# EasyEDA Pro project ws2812_clock_PCB.epro, board PCB1
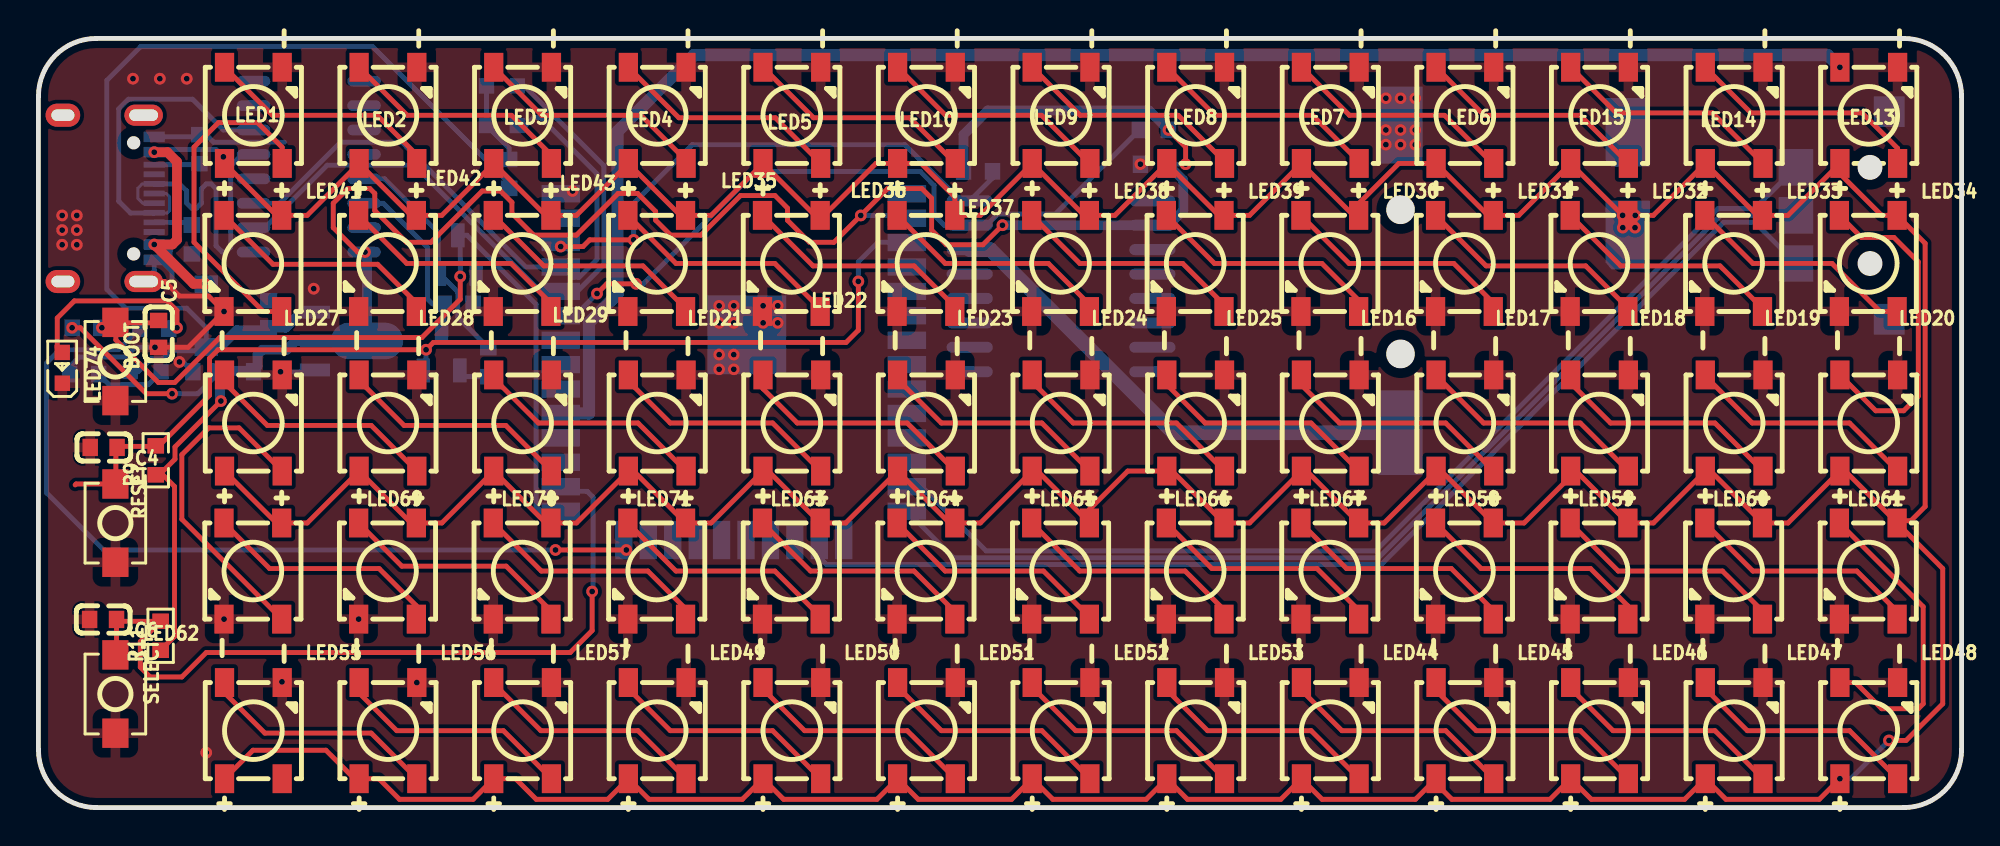
[diagram p4: board, top side]
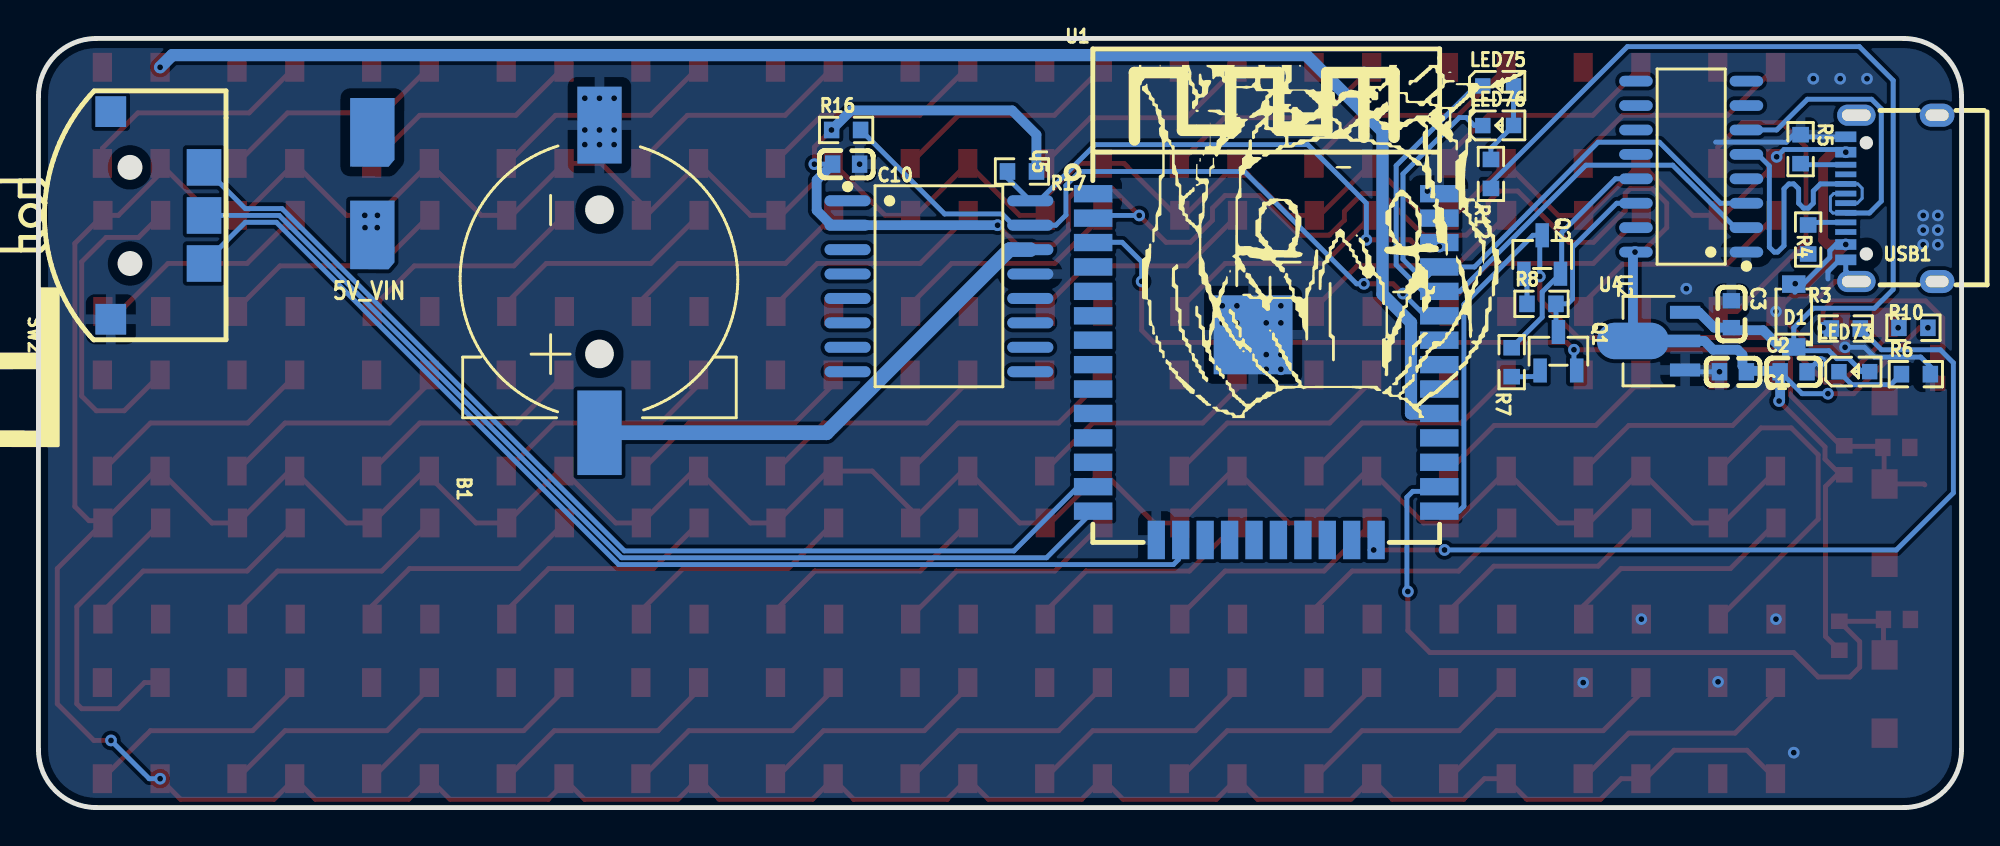
[diagram p5: board, bottom side, seen from below]

Outline 100 x 40 mm; copper layers: Top Layer, Bottom Layer. Coordinates in mm from the lower left corner of the outline.
Outline path: 0,37 0,3 arc(0.88,0.88) 3,0 97,0 arc(99.12,0.88) 100,3 100,37 arc(99.12,39.12) 97,40 3,40 arc(0.88,39.12) 0,37
Stack: Top Layer 0.035mm / Dielectric1 1.51mm FR4 er 4.5 / Bottom Layer 0.035mm

## Design rules (mm)
template: JLCPCB Capability(Two Layers Board)
spacing copperThickness1oz (default): track to track 0.102, other pairs 0.152 to 0.3
spacing copperThickness2oz: track to track 0.203, other pairs 0.152 to 0.3
track width copperThickness1oz (default): min 0.127, default 0.254, max 2.54
track width copperThickness2oz: min 0.203, default 0.254, max 2.54
differential pair differentialPair (default): width min 0.127, default 0.254, max 2.54; gap min 0.152, default 0.152
via viaSize (default): diameter min 0.5, default 0.61, max 10; hole min 0.3, default 0.305, max 6.3

## Placement (name value [footprint] x y rotation side)
B1  CR1220-2  [BAT-SMD_CR1220-2]  70.83 27.49 90 bottom
BOOT  -  [Key_SMD_3x4x2]  4 23.2 270 top
C1  10uF  [C0603]  11.89 22.66 0 bottom
C2  10uF  [C0603]  8.73 22.66 180 bottom
C3  100nF  [C0603]  11.97 25.66 270 bottom
C4  10uF  [C0603]  3.39 18.73 180 top
C5  10uF  [C0603]  6.25 24.63 270 top
C6  10uF  [C0603]  3.36 9.78 180 top
C10  100nF  [C0603]  58 33.46 0 bottom
D1  1N5819HW-7-F  [SOD-123_L2.7-W1.6-LS3.7-RD]  8.72 25.59 90 bottom
LED1  XL-5050RGBC-WS2812B  [LED-SMD_4P-L5.0-W5.0-BL_XL-5050RGBC]  11.17 36 0 top
LED2  XL-5050RGBC-WS2812B  [LED-SMD_4P-L5.0-W5.0-BL_XL-5050RGBC]  18.17 36 0 top
LED3  XL-5050RGBC-WS2812B  [LED-SMD_4P-L5.0-W5.0-BL_XL-5050RGBC]  25.17 36 0 top
LED4  XL-5050RGBC-WS2812B  [LED-SMD_4P-L5.0-W5.0-BL_XL-5050RGBC]  32.18 36 0 top
LED5  XL-5050RGBC-WS2812B  [LED-SMD_4P-L5.0-W5.0-BL_XL-5050RGBC]  39.18 36 0 top
LED6  XL-5050RGBC-WS2812B  [LED-SMD_4P-L5.0-W5.0-BL_XL-5050RGBC]  74.18 36 0 top
LED7  XL-5050RGBC-WS2812B  [LED-SMD_4P-L5.0-W5.0-BL_XL-5050RGBC]  67.18 36 0 top
LED8  XL-5050RGBC-WS2812B  [LED-SMD_4P-L5.0-W5.0-BL_XL-5050RGBC]  60.18 36 0 top
LED9  XL-5050RGBC-WS2812B  [LED-SMD_4P-L5.0-W5.0-BL_XL-5050RGBC]  53.18 36 0 top
LED10  XL-5050RGBC-WS2812B  [LED-SMD_4P-L5.0-W5.0-BL_XL-5050RGBC]  46.18 36 0 top
LED13  XL-5050RGBC-WS2812B  [LED-SMD_4P-L5.0-W5.0-BL_XL-5050RGBC]  95.18 36 0 top
LED14  XL-5050RGBC-WS2812B  [LED-SMD_4P-L5.0-W5.0-BL_XL-5050RGBC]  88.18 36 0 top
LED15  XL-5050RGBC-WS2812B  [LED-SMD_4P-L5.0-W5.0-BL_XL-5050RGBC]  81.18 36 0 top
LED16  XL-5050RGBC-WS2812B  [LED-SMD_4P-L5.0-W5.0-BL_XL-5050RGBC]  67.15 28.3 180 top
LED17  XL-5050RGBC-WS2812B  [LED-SMD_4P-L5.0-W5.0-BL_XL-5050RGBC]  74.15 28.3 180 top
LED18  XL-5050RGBC-WS2812B  [LED-SMD_4P-L5.0-W5.0-BL_XL-5050RGBC]  81.15 28.3 180 top
LED19  XL-5050RGBC-WS2812B  [LED-SMD_4P-L5.0-W5.0-BL_XL-5050RGBC]  88.15 28.3 180 top
LED20  XL-5050RGBC-WS2812B  [LED-SMD_4P-L5.0-W5.0-BL_XL-5050RGBC]  95.15 28.3 180 top
LED21  XL-5050RGBC-WS2812B  [LED-SMD_4P-L5.0-W5.0-BL_XL-5050RGBC]  32.15 28.3 180 top
LED22  XL-5050RGBC-WS2812B  [LED-SMD_4P-L5.0-W5.0-BL_XL-5050RGBC]  39.15 28.3 180 top
LED23  XL-5050RGBC-WS2812B  [LED-SMD_4P-L5.0-W5.0-BL_XL-5050RGBC]  46.15 28.3 180 top
LED24  XL-5050RGBC-WS2812B  [LED-SMD_4P-L5.0-W5.0-BL_XL-5050RGBC]  53.15 28.3 180 top
LED25  XL-5050RGBC-WS2812B  [LED-SMD_4P-L5.0-W5.0-BL_XL-5050RGBC]  60.15 28.3 180 top
LED27  XL-5050RGBC-WS2812B  [LED-SMD_4P-L5.0-W5.0-BL_XL-5050RGBC]  11.15 28.3 180 top
LED28  XL-5050RGBC-WS2812B  [LED-SMD_4P-L5.0-W5.0-BL_XL-5050RGBC]  18.15 28.3 180 top
LED29  XL-5050RGBC-WS2812B  [LED-SMD_4P-L5.0-W5.0-BL_XL-5050RGBC]  25.15 28.3 180 top
LED30  XL-5050RGBC-WS2812B  [LED-SMD_4P-L5.0-W5.0-BL_XL-5050RGBC]  39.18 20 0 top
LED31  XL-5050RGBC-WS2812B  [LED-SMD_4P-L5.0-W5.0-BL_XL-5050RGBC]  32.18 20 0 top
LED32  XL-5050RGBC-WS2812B  [LED-SMD_4P-L5.0-W5.0-BL_XL-5050RGBC]  25.17 20 0 top
LED33  XL-5050RGBC-WS2812B  [LED-SMD_4P-L5.0-W5.0-BL_XL-5050RGBC]  18.17 20 0 top
LED34  XL-5050RGBC-WS2812B  [LED-SMD_4P-L5.0-W5.0-BL_XL-5050RGBC]  11.17 20 0 top
LED35  XL-5050RGBC-WS2812B  [LED-SMD_4P-L5.0-W5.0-BL_XL-5050RGBC]  74.18 20 0 top
LED36  XL-5050RGBC-WS2812B  [LED-SMD_4P-L5.0-W5.0-BL_XL-5050RGBC]  67.18 20 0 top
LED37  XL-5050RGBC-WS2812B  [LED-SMD_4P-L5.0-W5.0-BL_XL-5050RGBC]  60.18 20 0 top
LED38  XL-5050RGBC-WS2812B  [LED-SMD_4P-L5.0-W5.0-BL_XL-5050RGBC]  53.18 20 0 top
LED39  XL-5050RGBC-WS2812B  [LED-SMD_4P-L5.0-W5.0-BL_XL-5050RGBC]  46.18 20 0 top
LED41  XL-5050RGBC-WS2812B  [LED-SMD_4P-L5.0-W5.0-BL_XL-5050RGBC]  95.18 20 0 top
LED42  XL-5050RGBC-WS2812B  [LED-SMD_4P-L5.0-W5.0-BL_XL-5050RGBC]  88.18 20 0 top
LED43  XL-5050RGBC-WS2812B  [LED-SMD_4P-L5.0-W5.0-BL_XL-5050RGBC]  81.18 20 0 top
LED44  XL-5050RGBC-WS2812B  [LED-SMD_4P-L5.0-W5.0-BL_XL-5050RGBC]  67.15 12.3 180 top
LED45  XL-5050RGBC-WS2812B  [LED-SMD_4P-L5.0-W5.0-BL_XL-5050RGBC]  74.15 12.3 180 top
LED46  XL-5050RGBC-WS2812B  [LED-SMD_4P-L5.0-W5.0-BL_XL-5050RGBC]  81.15 12.3 180 top
LED47  XL-5050RGBC-WS2812B  [LED-SMD_4P-L5.0-W5.0-BL_XL-5050RGBC]  88.15 12.3 180 top
LED48  XL-5050RGBC-WS2812B  [LED-SMD_4P-L5.0-W5.0-BL_XL-5050RGBC]  95.15 12.3 180 top
LED49  XL-5050RGBC-WS2812B  [LED-SMD_4P-L5.0-W5.0-BL_XL-5050RGBC]  32.15 12.3 180 top
LED50  XL-5050RGBC-WS2812B  [LED-SMD_4P-L5.0-W5.0-BL_XL-5050RGBC]  39.15 12.3 180 top
LED51  XL-5050RGBC-WS2812B  [LED-SMD_4P-L5.0-W5.0-BL_XL-5050RGBC]  46.15 12.3 180 top
LED52  XL-5050RGBC-WS2812B  [LED-SMD_4P-L5.0-W5.0-BL_XL-5050RGBC]  53.15 12.3 180 top
LED53  XL-5050RGBC-WS2812B  [LED-SMD_4P-L5.0-W5.0-BL_XL-5050RGBC]  60.15 12.3 180 top
LED55  XL-5050RGBC-WS2812B  [LED-SMD_4P-L5.0-W5.0-BL_XL-5050RGBC]  11.15 12.3 180 top
LED56  XL-5050RGBC-WS2812B  [LED-SMD_4P-L5.0-W5.0-BL_XL-5050RGBC]  18.15 12.3 180 top
LED57  XL-5050RGBC-WS2812B  [LED-SMD_4P-L5.0-W5.0-BL_XL-5050RGBC]  25.15 12.3 180 top
LED58  XL-5050RGBC-WS2812B  [LED-SMD_4P-L5.0-W5.0-BL_XL-5050RGBC]  39.18 4 0 top
LED59  XL-5050RGBC-WS2812B  [LED-SMD_4P-L5.0-W5.0-BL_XL-5050RGBC]  32.18 4 0 top
LED60  XL-5050RGBC-WS2812B  [LED-SMD_4P-L5.0-W5.0-BL_XL-5050RGBC]  25.17 4 0 top
LED61  XL-5050RGBC-WS2812B  [LED-SMD_4P-L5.0-W5.0-BL_XL-5050RGBC]  18.17 4 0 top
LED62  XL-5050RGBC-WS2812B  [LED-SMD_4P-L5.0-W5.0-BL_XL-5050RGBC]  11.17 4 0 top
LED63  XL-5050RGBC-WS2812B  [LED-SMD_4P-L5.0-W5.0-BL_XL-5050RGBC]  74.18 4 0 top
LED64  XL-5050RGBC-WS2812B  [LED-SMD_4P-L5.0-W5.0-BL_XL-5050RGBC]  67.18 4 0 top
LED65  XL-5050RGBC-WS2812B  [LED-SMD_4P-L5.0-W5.0-BL_XL-5050RGBC]  60.18 4 0 top
LED66  XL-5050RGBC-WS2812B  [LED-SMD_4P-L5.0-W5.0-BL_XL-5050RGBC]  53.18 4 0 top
LED67  XL-5050RGBC-WS2812B  [LED-SMD_4P-L5.0-W5.0-BL_XL-5050RGBC]  46.18 4 0 top
LED69  XL-5050RGBC-WS2812B  [LED-SMD_4P-L5.0-W5.0-BL_XL-5050RGBC]  95.18 4 0 top
LED70  XL-5050RGBC-WS2812B  [LED-SMD_4P-L5.0-W5.0-BL_XL-5050RGBC]  88.18 4 0 top
LED71  XL-5050RGBC-WS2812B  [LED-SMD_4P-L5.0-W5.0-BL_XL-5050RGBC]  81.18 4 0 top
LED73  -  [LED_0603]  5.52 22.68 180 bottom
LED74  -  [LED_0603]  1.23 22.92 90 top
LED75  -  [LED_0603]  24.05 37.54 180 bottom
LED76  -  [LED_0603]  24.05 35.48 180 bottom
NOREF  -  [Pad_e1269]  82.64 29.78 0 top
NOREF#2  -  [Pad_e1268]  82.64 35.11 0 top
Q1  S8050  [SOT-23-3_L2.9-W1.3-P1.90-LS2.4-BR]  20.96 23.73 270 bottom
Q2  S8050  [SOT-23-3_L2.9-W1.3-P1.90-LS2.4-BR]  21.81 28.76 270 bottom
R3  1K  [R0603]  6.02 24.91 180 bottom
R4  5K1  [R0603]  7.98 29.54 90 bottom
R5  5K1  [R0603]  8.37 34.24 270 bottom
R6  1K  [R0603]  2.38 22.54 180 bottom
R7  10K  [R0603]  23.39 23.16 90 bottom
R8  10K  [R0603]  21.84 26.2 180 bottom
R9  10K  [R0603]  6.1 18.06 90 top
R10  10K  [R0603]  2.5 24.95 0 bottom
R11  10K  [R0603]  6.35 8.93 90 top
R12  10K  [R0603]  24.47 32.95 90 bottom
R16  4.7K  [R0603]  58 35.24 180 bottom
R17  4.7K  [R0603]  48.86 33.08 0 bottom
RESET  -  [Key_SMD_3x4x2]  4 14.79 270 top
SELECT  -  [Key_SMD_3x4x2]  4 5.9 270 top
SW2  TM-2022-3  [SW-SMD_TM-2022-3]  93.81 30.8 90 bottom
U1  ESP32-WROOM-32-N4  [WIFIM-SMD_ESP32-WROOM-32-N4]  36.16 22.92 180 bottom
U2  CH340C  [SOP-16_L10.0-W3.9-P1.27-LS6.0-BL]  14.06 33.33 90 bottom
U4  AMS1117-3.3  [SOT-89_L4.5-W2.5-P1.50-LS4.2-BR]  15.73 24.26 180 bottom
U5  DS3231SN#  [SOIC-16_L10.3-W7.5-P1.27-LS10.3-BL]  53.18 27.11 270 bottom
USB1  TYPE-C 16PIN 2MD(073)  [USB-C-SMD_TYPE-C-6PIN-2MD-073]  3.64 31.68 90 bottom

## Footprints (pads in the part's own frame, mm; a bottom-side part is the same pattern mirrored in y, then rotated)
BAT-SMD_CR1220-2
  rect 4.4x2.3 smd: 1(-8,0)
  rect 4x2.3 smd: 2(8,0)
C0603
  rect 0.8x0.9 smd: 1(-0.7,0) 2(0.7,0)
Key_SMD_3x4x2
  rect 1.53x1.36 smd: 1(-2.035,0) 2(2.035,0)
LED-SMD_4P-L5.0-W5.0-BL_XL-5050RGBC
  rect 1x1.5 smd: 1(-1.5,-2.5) 2(1.5,-2.5) 3(1.5,2.5) 4(-1.5,2.5)
LED_0603
  rect 0.8x0.8 smd: 1(-0.851,-0.01) 2(0.75,-0.005)
Pad_e1268
  custom 2.309x3.577 smd far side: 40(0,0)
Pad_e1269
  custom 2.309x3.577 smd far side: 40(0,0)
R0603
  rect 0.806x0.864 smd: 1(-0.753,0) 2(0.753,0)
SOD-123_L2.7-W1.6-LS3.7-RD
  rect 0.91x1.22 smd: 1(-1.635,0) 2(1.635,0)
SOIC-16_L10.3-W7.5-P1.27-LS10.3-BL
  oval 0.574x2.401 smd: 1(-4.445,-4.75) 2(-3.175,-4.75) 3(-1.905,-4.75) 4(-0.635,-4.75) 5(0.635,-4.75) 6(1.905,-4.75) 7(3.175,-4.75) 8(4.445,-4.75) 9(4.445,4.75) 10(3.175,4.75) 11(1.905,4.75) 12(0.635,4.75) 13(-0.635,4.75) 14(-1.905,4.75) 15(-3.175,4.75) 16(-4.445,4.75)
SOP-16_L10.0-W3.9-P1.27-LS6.0-BL
  oval 0.56x1.745 smd: 1(-4.445,-2.873) 2(-3.175,-2.873) 3(-1.905,-2.873) 4(-0.635,-2.873) 5(0.635,-2.873) 6(1.905,-2.873) 7(3.175,-2.873) 8(4.445,-2.873) 9(4.445,2.873) 10(3.175,2.873) 11(1.905,2.873) 12(0.635,2.873) 13(-0.635,2.873) 14(-1.905,2.873) 15(-3.175,2.873) 16(-4.445,2.873)
SOT-23-3_L2.9-W1.3-P1.90-LS2.4-BR
  rect 1.25x0.7 smd: 1(1,-0.95) 2(1,0.95) 3(-1,0)
SOT-89_L4.5-W2.5-P1.50-LS4.2-BR
  rect 1.575x0.672 smd: 1(1.356,-1.5) 3(1.356,1.5)
  custom 5.377x1.9 smd: 2(-1.356,0.009)
SW-SMD_TM-2022-3
  rect 1.6x1.6 smd: a(-5.4,2.425) a(5.4,2.425)
  rect 1.9x1.8 smd: b(2.5,-2.425) c(0,-2.425) d(-2.5,-2.425)
USB-C-SMD_TYPE-C-6PIN-2MD-073
  rect 0.55x1.1 smd: 1(-3.2,2.375) 2(-2.4,2.375) 11(2.4,2.375) 12(3.2,2.375)
  rect 0.3x1.1 smd: 3(-1.75,2.375) 4(-1.25,2.375) 5(-0.75,2.375) 6(-0.25,2.375) 7(0.25,2.375) 8(0.75,2.375) 9(1.25,2.375) 10(1.75,2.375)
  oval 1.2x1.8 hole 0.6x1.2: 13(-4.325,-2.375) 14(4.325,-2.375)
  oval 1.1x2 hole 0.6x1.5: 13(-4.325,1.825) 14(4.325,1.825)
WIFIM-SMD_ESP32-WROOM-32-N4
  rect 2x0.9 smd: 1(-9,9.005) 2(-9,7.735) 3(-9,6.465) 4(-9,5.195) 5(-9,3.925) 6(-9,2.655) 7(-9,1.385) 8(-9,0.115) 9(-9,-1.155) 10(-9,-2.425) 11(-9,-3.695) 12(-9,-4.965) 13(-9,-6.235) 14(-9,-7.505) 25(9,-7.505) 26(9,-6.235) 27(9,-4.965) 28(9,-3.695) 29(9,-2.425) 30(9,-1.155) 31(9,0.115) 32(9,1.385) 33(9,2.655) 34(9,3.925) 35(9,5.195) 36(9,6.465) 37(9,7.735) 38(9,9.005)
  rect 0.9x2 smd: 15(-5.715,-9.005) 16(-4.445,-9.005) 17(-3.175,-9.005) 18(-1.905,-9.005) 19(-0.635,-9.005) 20(0.635,-9.005) 21(1.905,-9.005) 22(3.175,-9.005) 23(4.445,-9.005) 24(5.715,-9.005)
  rect 4.1x4.1 smd: 39(-0.68,1.665)

## Nets
As in the schematic, except:
GND: B1.2 BOOT.2 C1.2 C2.2 C3.1 C4.2 C5.2 C6.2 C10.1 LED1.3 LED2.3 LED3.3 LED4.3 LED5.3 LED6.3 LED7.3 LED8.3 LED9.3 LED10.3 LED13.3 LED14.3 LED15.3 LED16.3 LED17.3 LED18.3 LED19.3 LED20.3 LED21.3 LED22.3 LED23.3 LED24.3 LED25.3 LED27.3 LED28.3 LED29.3 LED30.3 LED31.3 LED32.3 LED33.3 LED34.3 LED35.3 LED36.3 LED37.3 LED38.3 LED39.3 LED41.3 LED42.3 LED43.3 LED44.3 LED45.3 LED46.3 LED47.3 LED48.3 LED49.3 LED50.3 LED51.3 LED52.3 LED53.3 LED55.3 LED56.3 LED57.3 LED58.3 LED59.3 LED60.3 LED61.3 LED62.3 LED63.3 LED64.3 LED65.3 LED66.3 LED67.3 LED69.3 LED70.3 LED71.3 LED74.1 NOREF#2.40 R4.1 R5.1 R6.2 RESET.2 SELECT.2 SW2.a U1.1 U1.15 U1.38 U1.39 U2.1 U4.1 U5.13 USB1.1 USB1.12
VBUS: D1.2 LED1.1 LED2.1 LED3.1 LED4.1 LED5.1 LED6.1 LED7.1 LED8.1 LED9.1 LED10.1 LED13.1 LED14.1 LED15.1 LED16.1 LED17.1 LED18.1 LED19.1 LED20.1 LED21.1 LED22.1 LED23.1 LED24.1 LED25.1 LED27.1 LED28.1 LED29.1 LED30.1 LED31.1 LED32.1 LED33.1 LED34.1 LED35.1 LED36.1 LED37.1 LED38.1 LED39.1 LED41.1 LED42.1 LED43.1 LED44.1 LED45.1 LED46.1 LED47.1 LED48.1 LED49.1 LED50.1 LED51.1 LED52.1 LED53.1 LED55.1 LED56.1 LED57.1 LED58.1 LED59.1 LED60.1 LED61.1 LED62.1 LED63.1 LED64.1 LED65.1 LED66.1 LED67.1 LED69.1 LED70.1 LED71.1 NOREF.40 USB1.2 USB1.11

Pads without a net: LED62 2; U1 4 5 6 7 8 9 10 11 12 17 18 19 20 22 23 27 28 30 31 32 37; U2 4 7 8 9 10 11 12 15; U5 1 3 4 5 6 7 8 9 10 11 12; USB1 3 9 13 14

## Via types
v1: diameter 0.61, hole 0.305, Top Layer to Bottom Layer, 73 vias

## Routing (per net, layer and track width the routed paths; a pad name or vN(x,y) marks a point on that pad's centre or on a via; arc(x,y) is an arc through that point)
3V3: length 122
  Top Layer w0.254: v1(6.95,21.52) 5.61,21.52 2.18,24.95 v1(1.75,24.95) ; R11.1 7.07,8.9 7.07,16.7 6.47,17.31 6.29,17.31 ; 6.29,17.31 7.1,18.12 7.1,18.76 v1(9.49,21.14) ; 6.29,17.31 R9.1 ; v1(58.76,35.24) 59.65,34.35 v1(59.65,33.46) ; v1(16.98,28.89) 16.6,28.89 15.33,30.16 15.33,31.43 16.09,32.19 17.23,32.19 17.49,31.94 17.49,31.05 19.14,29.4 20.41,29.4 23.08,32.06 24.03,32.06 24.62,31.47 24.62,30.9 25.75,29.77 27.97,29.77 30.14,31.94 31.16,31.94 32.09,31 32.09,30.55 32.87,29.77 34.45,29.77 36.51,31.83 38.3,31.83 38.95,31.18 38.95,30.54 40.09,29.4 41.36,29.4 v1(42.76,30.8) 44.16,32.19 45.94,32.19 46.44,31.68 46.44,30.03 47.21,29.27 49.11,29.27 v1(50.13,30.29)
  Bottom Layer w0.254: C2.1 8.29,21.52 v1(6.95,21.52) ; C10.2 v1(59.65,33.46) ; v1(58.76,35.24) R16.1 ; U1.2 45.02,30.8 v1(42.76,30.8)
  Bottom Layer w0.508: U2.16 17.09,28.73 17.09,24.27 13.37,24.27 12.92,23.81 11.65,23.81 11.39,23.56 11.39,22.97 11.14,22.71 ; 11.14,22.71 9.48,22.71 C2.1 9.43,21.2 v1(9.49,21.14) ; 11.14,22.71 C1.1 ; v1(50.13,30.29) 58.76,30.29 59.53,31.06 59.53,32.63 C10.2 ; R17.1 48.1,34.99 49.37,36.26 57.75,36.26 v1(58.76,35.24)
+5V: length 53.6
  Bottom Layer w0.254: LED73.2 5.19,22.67 5.86,23.35 6.48,23.35 6.9,23.76 8.53,23.76 D1.1 8.72,24.95 7.71,25.97 4.53,25.97 3.56,26.95 3.56,37.82 5.31,39.57 17.38,39.57 24.47,32.48 R12.1
  Bottom Layer w0.508: U4.3 13.66,25.76 12.86,24.96 C3.2 11.83,24.83 10.32,24.83 9.44,23.95 D1.1
GND: length 27.1
  Top Layer w0.254: 5.47,27.36 6.57,27.36 7.33,26.6 8.85,26.6 v1(9.65,25.8) 7.79,23.94 v1(6.06,23.94)
  Bottom Layer w0.254: v1(6.06,23.94) 5.04,23.94 4.53,23.43 2.12,23.43 1.62,22.93 R6.2 ; 8.03,22.66 7.52,23.17 v1(7.33,23.17) ; USB1.12 8.26,34.88 R5.1 8.72,35 9.11,34.61 12.79,34.61 ; v1(12.59,22.66) 14.28,22.66 U4.1 ; 5.47,27.36 6.02,27.91 USB1.1 6.34,28.48 6.95,27.87 6.95,27.49
  vias: v1(1.23,30.8) v1(1.23,30.03) v1(1.23,29.27) v1(1.99,30.8) v1(1.99,30.03) v1(1.99,29.27) v1(4.92,37.91) v1(6.31,37.91) v1(7.71,37.91) v1(8.72,2.86) v1(9.65,9.8) v1(12.66,6.54) v1(14.31,26.98) v1(16.65,9.8) v1(19.67,6.5) v1(27.78,32.06) v1(35.4,26.1) v1(35.4,25.21) v1(35.4,23.56) v1(35.4,22.79) v1(36.16,26.1) v1(36.16,25.21) v1(36.16,23.56) v1(36.16,22.79) v1(37.68,26.1) v1(37.68,25.21) v1(38.44,26.1) v1(38.44,25.21) v1(57.3,33.46) v1(70.07,36.89) v1(70.07,35.24) v1(70.07,34.48) v1(70.83,36.89) v1(70.83,35.24) v1(70.83,34.48) v1(71.59,36.89) v1(71.59,35.24) v1(71.59,34.48)
VBUS: length 380.4
  Top Layer w0.254: v1(93.68,1.5) 92.6,0.43 87.75,0.43 LED70.1 85.6,0.43 80.75,0.43 LED71.1 78.6,0.43 73.5,0.43 72.68,1.25 LED63.1 71.6,0.43 66.75,0.43 LED64.1 64.6,0.43 59.75,0.43 LED65.1 57.6,0.43 52.75,0.43 LED66.1 50.6,0.43 45.75,0.43 LED67.1 43.6,0.43 38.75,0.43 LED58.1 36.6,0.43 31.75,0.43 LED59.1 29.6,0.43 25.89,0.43 24.81,1.5 LED60.1 22.6,0.43 18.77,0.43 17.7,1.5 LED61.1 16.43,1.5 14.95,2.98 11.16,2.98 LED62.1 ; 79.95,17.5 77.25,14.8 LED45.1 72.95,17.5 LED35.1 69.97,14.8 LED44.1 65.95,17.5 LED36.1 62.97,14.8 LED53.1 58.95,17.5 LED37.1 56.64,17.5 54.65,15.51 LED52.1 51.95,17.5 LED38.1 48.97,14.8 LED51.1 47.38,14.8 LED39.1 41.97,14.8 LED50.1 37.95,17.5 LED30.1 34.97,14.8 LED49.1 30.95,17.5 LED31.1 27.97,14.8 LED57.1 26.38,14.8 LED32.1 20.97,14.8 LED56.1 19.38,14.8 LED33.1 13.97,14.8 LED55.1 12.38,14.8 LED34.1 ; 79.95,17.5 LED46.1 83.97,14.8 LED42.1 86.95,17.5 LED47.1 90.97,14.8 LED41.1 93.95,17.5 LED48.1 ; 79.95,17.5 LED43.1 ; v1(96.23,3.49) 97.12,3.49 99.02,5.39 99.02,12.43 LED48.1 ; 40.85,30.8 LED22.1 ; 40.85,30.8 43.55,33.5 LED10.1 45.9,33.5 47.65,31.75 LED23.1 48.97,30.8 LED9.1 54.38,30.8 LED24.1 55.97,30.8 LED8.1 61.38,30.8 LED25.1 62.97,30.8 LED7.1 68.38,30.8 LED16.1 68.65,31.41 70.74,33.5 LED6.1 75.38,30.8 LED17.1 76.97,30.8 LED15.1 v1(82.38,30.8) LED18.1 v1(83.03,30.8) 83.97,30.8 LED14.1 89.38,30.8 LED19.1 90.97,30.8 LED13.1 93.68,32.97 95.84,30.8 LED20.1 98.11,29.34 98.11,15.66 97.37,14.92 96.77,14.92 LED48.1 ; 40.85,30.8 40.85,30.41 40.76,30.41 LED5.1 34.97,30.8 LED21.1 33.38,30.8 LED4.1 27.97,30.8 LED29.1 26.38,30.8 LED3.1 20.97,30.8 LED28.1 19.38,30.8 LED2.1 13.97,30.8 LED27.1 12.38,30.8 LED1.1
  Top Layer w0.508: v1(6.02,34.08) 6.71,34.08 7.2,33.59 7.2,29.53 6.96,29.28 v1(6.02,29.28) 8.06,27.24 8.6,27.24
  Bottom Layer w0.254: v1(6.02,34.08) 6.16,34.22 9.23,34.22 v1(9.61,33.84) ; v1(96.23,3.49) 94.24,1.5 v1(93.68,1.5) ; 8.67,26.8 8.23,27.24 8.22,27.24 6.85,28.61 6.85,28.97 6.53,29.28 v1(6.02,29.28)
  vias: v1(8.65,27.24) v1(82.38,30.16) v1(83.02,30.16)
D+: length 17.2
  Bottom Layer w0.152: USB1.8 5.39,32.43 5.17,32.21 5.17,31.68 5.42,31.43 USB1.6
  Bottom Layer w0.254: USB1.8 7.34,32.43 7.71,32.06 7.71,31.43 7.96,31.18 8.22,31.18 8.47,31.43 8.47,32.18 8.72,32.43 8.98,32.43 9.23,32.18 9.23,29.22 9.56,28.89 9.74,28.89 10,29.14 10,33.37 10.59,33.97 U2.5
D-: length 17.2
  Bottom Layer w0.152: USB1.7 6.65,31.93 6.82,31.76 6.82,31.05 6.69,30.92 6.03,30.92 USB1.5
  Bottom Layer w0.254: U2.6 9.61,35.24 8.02,36.84 4.68,36.84 4.17,36.33 4.17,31.54 4.79,30.92 6.01,30.92 USB1.5
DOWN_KEY: length 60.1
  Bottom Layer w0.254: SW2.d 89.25,30.44 87.63,30.44 69.83,12.64 40.98,12.64 40.73,12.89 40.73,13.92
DTR: length 12.1
  Bottom Layer w0.254: U2.13 18,32.7 20.79,29.91 20.79,27.83 Q2.2 21.81,26.81 21.81,25.5 R7.2
EN: length 54.1
  Top Layer w0.254: 1.91,16.78 1.96,16.83 4.03,16.83 4.03,18.75 4.06,18.78 6.07,18.78 R9.2 6.27,18.81 8.9,21.44 8.9,23.37 9.34,23.81 v1(20.16,23.81) 20.54,24.19 42,24.19 42.63,24.83 v1(42.63,27.37)
  Bottom Layer w0.254: 45.28,29.39 45.27,29.4 43.65,29.4 42.63,28.38 v1(42.63,27.37) ; v1(20.16,23.81) 20.16,22.88 Q1.2
IO0: length 44.7
  Top Layer w0.254: C5.1 6.12,25.21 4.03,25.21 4.03,24.32 6.24,22.11 7.09,22.11 9.42,24.44 19.94,24.44 21.93,26.44 v1(21.93,27.62)
  Bottom Layer w0.254: 27.28,15.42 26.13,15.42 25.88,15.67 25.88,26.17 22.28,29.76 Q2.3 21.93,29.64 v1(21.93,27.62)
  vias: v1(3.3,24.95)
IO2: length 43.7
  Top Layer w0.254: v1(26.89,13.4) v1(30.57,13.4)
  Bottom Layer w0.254: 5.27,24.91 4.16,23.81 1.11,23.81 0.43,23.13 0.43,16.36 3.39,13.4 v1(26.89,13.4)
IO4: length 40.5
  Top Layer w0.254: 4.03,7.94 4.06,7.97 C6.1 4.16,9.69 6.35,9.69 5.3,8.63 5.3,7.3 5.8,6.79 7.45,6.79 8.72,8.06 27.65,8.06 28.79,9.2 v1(28.79,11.24)
  Bottom Layer w0.254: v1(28.79,11.24) 28.84,11.29 28.84,16.14 28.54,16.44 27.53,16.44 27.28,16.69
LED_IN: length 82.1
  Bottom Layer w0.635: v1(93.68,38.5) 93.04,39.14 34.08,39.14 30.11,35.16 30.11,26.7 28.63,25.22 28.63,20.5 27.28,20.5
PUSH_KEY: length 54.6
  Bottom Layer w0.254: SW2.c 87.48,30.8 69.68,12.99 47.58,12.99 U1.14
RTS: length 9.4
  Bottom Layer w0.254: U2.14 17.93,31.43 20.23,29.13 20.23,26.45 20.48,26.2 R8.2 21.09,24.86 Q1.3
RXD: length 34.2
  Bottom Layer w0.254: U2.2 11.77,30.16 15.02,33.41 19.53,33.41 26.09,26.85 27.28,26.85 27.3,26.86 28.03,26.86 29.4,28.23 29.4,33.38 25.26,37.53 LED75.1
SCL: length 27.8
  Top Layer w0.254: v1(30.95,29.53) 28.66,29.53 28.32,29.18 v1(27.16,29.18)
  Bottom Layer w0.254: v1(30.95,29.53) 30.95,31.43 34,34.48 45.05,34.48 47.97,31.56 U5.16 49.61,32.74 R17.2
SDA: length 37.3
  Top Layer w0.254: v1(29.04,26.73) 29.55,27.24 v1(31.08,27.24)
  Bottom Layer w0.254: v1(29.04,26.73) 27.89,25.58 27.16,25.58 ; R16.2 52.88,30.87 49.88,30.87 49.3,30.29 47.1,30.29 46.57,30.81 46.57,32.36 45.85,33.08 37.3,33.08 31.46,27.24 v1(31.08,27.24)
TXD: length 32.5
  Bottom Layer w0.254: U2.3 12.53,31.43 15.71,34.61 18.9,34.61 25.33,28.12 27.28,28.12 27.82,27.58 28.11,27.58 29.04,28.51 29.04,32.95 26.11,35.89 25.75,35.89 25.34,35.47 LED76.1
UP_KEY: length 55.6
  Bottom Layer w0.254: SW2.b 89.25,31.15 87.33,31.15 69.53,13.35 49.28,13.35 45.61,17.01
$1N4092: length 12.5
  Top Layer w0.254: LED14.4 89.05,36.13 94.83,36.13 96.68,34.28 LED13.2
$1N4097: length 12.1
  Top Layer w0.254: LED7.2 68.68,33.58 66.26,36 61.17,36 LED8.4
$1N4102: length 12.1
  Top Layer w0.254: LED6.2 75.62,33.5 73.11,36 68.17,36 LED7.4
$1N4107: length 12.1
  Top Layer w0.254: LED9.4 54.17,36 59.27,36 61.68,33.6 LED8.2
$1N4112: length 12.1
  Top Layer w0.254: LED9.2 54.66,33.5 52.16,36 47.17,36 LED10.4
$1N4117: length 12.1
  Top Layer w0.254: LED5.4 40.3,35.88 45.3,35.88 LED10.2
$1N4122: length 12.1
  Top Layer w0.254: LED5.2 40.68,33.52 38.32,35.88 33.3,35.88 LED4.4
$1N4127: length 12.3
  Top Layer w0.254: LED2.2 19.67,33.94 17.61,36 12.17,36 LED1.4
$1N5780: length 12.1
  Top Layer w0.254: LED15.2 80.17,36 75.17,36 LED6.4
$1N5785: length 12.1
  Top Layer w0.254: LED14.2 87.05,36.13 82.05,36.13 LED15.4
$1N5790: length 12.3
  Top Layer w0.254: LED2.4 19.17,36 24.6,36 26.67,33.93 LED3.2
$1N5795: length 12.2
  Top Layer w0.254: LED4.2 33.68,33.66 31.33,36 26.17,36 LED3.4
$1N7419: length 12.1
  Top Layer w0.254: LED20.4 95.76,25.8 93.26,28.3 89.15,28.3 LED19.2
$1N7423: length 12.2
  Top Layer w0.254: LED18.2 82.28,28.17 87.44,28.17 89.65,25.96 LED19.4
$1N7427: length 12.2
  Top Layer w0.254: LED18.4 82.65,25.98 80.45,28.17 75.28,28.17 LED17.2
$1N7431: length 12.3
  Top Layer w0.254: LED16.2 68.15,28.3 73.6,28.3 75.65,26.25 LED17.4
$1N7435: length 12.4
  Top Layer w0.254: LED16.4 68.65,26.39 66.74,28.3 61.15,28.3 LED25.2
$1N7439: length 12.3
  Top Layer w0.254: LED24.2 54.15,28.3 59.5,28.3 61.65,26.15 LED25.4
$1N7443: length 12.3
  Top Layer w0.254: LED23.2 47.15,28.3 52.51,28.3 54.65,26.16 LED24.4
$1N7447: length 12.2
  Top Layer w0.254: LED22.2 40.28,28.17 45.53,28.17 47.65,26.05 LED23.4
$1N7451: length 12.2
  Top Layer w0.254: LED21.2 33.15,28.3 38.29,28.3 40.65,25.94 LED22.4
$1N7455: length 12.2
  Top Layer w0.254: LED29.2 26.28,28.17 31.43,28.17 33.65,25.95 LED21.4
$1N7459: length 12.3
  Top Layer w0.254: LED28.2 19.15,28.3 24.57,28.3 26.65,26.22 LED29.4
$1N7463: length 12.3
  Top Layer w0.254: LED27.2 12.19,28.25 17.63,28.25 19.65,26.24 LED28.4
$1N7531: length 17.5
  Top Layer w0.254: LED27.4 11.69,25.8 8.09,29.4 8.09,34.35 9.36,35.62 11.39,35.62 12.67,34.34 LED1.2
$1N9831: length 12.3
  Top Layer w0.254: LED33.2 17.3,19.87 11.9,19.87 9.67,22.1 LED34.4
$1N9835: length 12.2
  Top Layer w0.254: LED32.2 24.3,19.87 19.01,19.87 16.67,22.21 LED33.4
$1N9839: length 12.2
  Top Layer w0.254: LED31.2 31.18,20 26,20 23.67,22.32 LED32.4
$1N9843: length 12.3
  Top Layer w0.254: LED30.2 38.18,20 32.85,20 30.68,22.18 LED31.4
$1N9847: length 12.5
  Top Layer w0.254: LED39.2 45.18,20 39.46,20 37.68,21.78 LED30.4
$1N9851: length 12.2
  Top Layer w0.254: LED39.4 44.68,22.28 46.95,20 52.18,20 LED38.2
$1N9855: length 12.3
  Top Layer w0.254: LED37.2 59.18,20 53.81,20 51.68,22.14 LED38.4
$1N9859: length 12.4
  Top Layer w0.254: LED36.2 66.18,20 60.67,20 58.68,21.99 LED37.4
$1N9863: length 12.4
  Top Layer w0.254: LED36.4 65.68,21.98 67.65,20 73.18,20 LED35.2
$1N9867: length 12.1
  Top Layer w0.254: LED43.2 80.18,20 75.15,20 72.68,22.47 LED35.4
$1N9871: length 12.3
  Top Layer w0.254: LED42.2 87.18,20 81.75,20 79.68,22.08 LED43.4
$1N9875: length 12.1
  Top Layer w0.254: LED42.4 86.68,22.44 89.12,20 94.18,20 LED41.2
$1N10622: length 12.3
  Top Layer w0.254: LED48.4 96.65,10.2 94.55,12.3 89.15,12.3 LED47.2
$1N10626: length 12.3
  Top Layer w0.254: LED46.2 82.15,12.3 87.57,12.3 89.65,10.22 LED47.4
$1N10630: length 12.5
  Top Layer w0.254: LED45.2 75.02,12.43 80.71,12.43 82.65,10.49 LED46.4
$1N10634: length 12.3
  Top Layer w0.254: LED44.2 68.02,12.43 73.47,12.43 75.65,10.25 LED45.4
$1N10638: length 12.3
  Top Layer w0.254: LED44.4 68.65,10.26 66.48,12.43 61.02,12.43 LED53.2
$1N10642: length 12.4
  Top Layer w0.254: LED52.2 54.15,12.3 59.63,12.3 61.65,10.28 LED53.4
$1N10646: length 12.1
  Top Layer w0.254: LED52.4 54.65,9.91 52.26,12.3 47.15,12.3 LED51.2
$1N10650: length 12.3
  Top Layer w0.254: LED51.4 47.65,10.18 45.53,12.3 40.15,12.3 LED50.2
$1N10654: length 12.2
  Top Layer w0.254: LED49.2 33.15,12.3 38.29,12.3 40.65,9.94 LED50.4
$1N10658: length 12.4
  Top Layer w0.254: LED57.2 26.15,12.3 31.69,12.3 33.65,10.34 LED49.4
$1N10662: length 12.3
  Top Layer w0.254: LED57.4 26.65,10.23 24.32,12.56 18.89,12.56 LED56.2
$1N10666: length 12.5
  Top Layer w0.254: LED56.4 19.65,10.5 17.72,12.43 12.02,12.43 LED55.2
$1N11413: length 12.4
  Top Layer w0.254: LED61.2 17.3,3.87 11.77,3.87 9.67,5.97 LED62.4
$1N11417: length 12.4
  Top Layer w0.254: LED60.2 24.18,4 18.63,4 16.67,5.95 LED61.4
$1N11421: length 12.1
  Top Layer w0.254: LED60.4 23.67,6.45 26.12,4 31.18,4 LED59.2
$1N11425: length 12.3
  Top Layer w0.254: LED58.2 38.18,4 32.85,4 30.68,6.18 LED59.4
$1N11429: length 12.3
  Top Layer w0.254: LED67.2 45.18,4 39.84,4 37.68,6.16 LED58.4
$1N11433: length 12.2
  Top Layer w0.254: LED67.4 44.68,6.28 46.95,4 52.18,4 LED66.2
$1N11437: length 12.2
  Top Layer w0.254: LED66.4 51.68,6.26 53.94,4 59.18,4 LED65.2
$1N11441: length 12.3
  Top Layer w0.254: LED64.2 66.18,4 60.79,4 58.68,6.12 LED65.4
$1N11445: length 12.3
  Top Layer w0.254: LED63.2 73.18,4 67.78,4 65.68,6.1 LED64.4
$1N11449: length 12.3
  Top Layer w0.254: LED71.2 80.18,4 74.76,4 72.68,6.09 LED63.4
$1N11453: length 12.2
  Top Layer w0.254: LED71.4 79.68,6.2 81.88,4 87.18,4 LED70.2
$1N11457: length 12.3
  Top Layer w0.254: LED70.4 86.68,6.19 88.86,4 94.18,4 LED69.2
$1N11461: length 16.2
  Top Layer w0.254: LED48.2 98.01,10.44 98.01,5.39 97.75,5.14 95.85,5.14 94.49,6.5 LED69.4
$1N11531: length 17.3
  Top Layer w0.254: LED20.2 94.8,29.65 96.48,29.65 97.75,28.38 97.75,21.4 96.99,20.64 95.54,20.64 LED41.4
$1N11542: length 17.4
  Top Layer w0.254: LED55.4 7.45,14.99 7.45,18.35 8.85,19.75 10.43,19.75 LED34.2
$1N14391: length 2.4
  Bottom Layer w0.254: R5.2 8.31,33.43 USB1.10
$1N14400: length 2.1
  Bottom Layer w0.254: USB1.4 7.58,30.43 7.98,30.04
$1N15566: length 3.8
  Bottom Layer w0.254: LED73.1 5.7,21.99 3.68,21.99 R6.1
$1N15790: length 1.6
  Bottom Layer w0.254: R7.1 22.57,22.41 22.57,22.41 22.23,22.41 Q1.1
$1N15816: length 1.6
  Bottom Layer w0.254: Q2.1 22.6,27.6 R8.1
$1N18906: length 10
  Top Layer w0.254: LED74.2 0.98,23.93 0.98,25.46 1.87,26.35 6.69,26.35 7.2,25.84 v1(7.2,24.95)
  Bottom Layer w0.254: R3.1 7.16,24.91 v1(7.2,24.95)
$1N24522: length 4.3
  Bottom Layer w0.254: R12.2 24.47,34.3 LED76.2 LED75.2
$1N28114: length 26.3
  Bottom Layer w0.762: U5.14 49.5,29.02 59.03,19.49 B1.1

## Copper pours and planes (outline as drawn; the poured copper is in the pictures)
GND on Top Layer: -31.03,72.58 101.44,72.58 101.44,-1.97 -31.03,-1.97
GND on Bottom Layer: -0.38,41.33 121.92,41.33 121.92,-22.17 -0.38,-22.17

## Text on the board
Bottom Silkscreen Layer: 5V_VIN
